# Altium project MASTER_HW.PrjPcb (part 1 of 3)
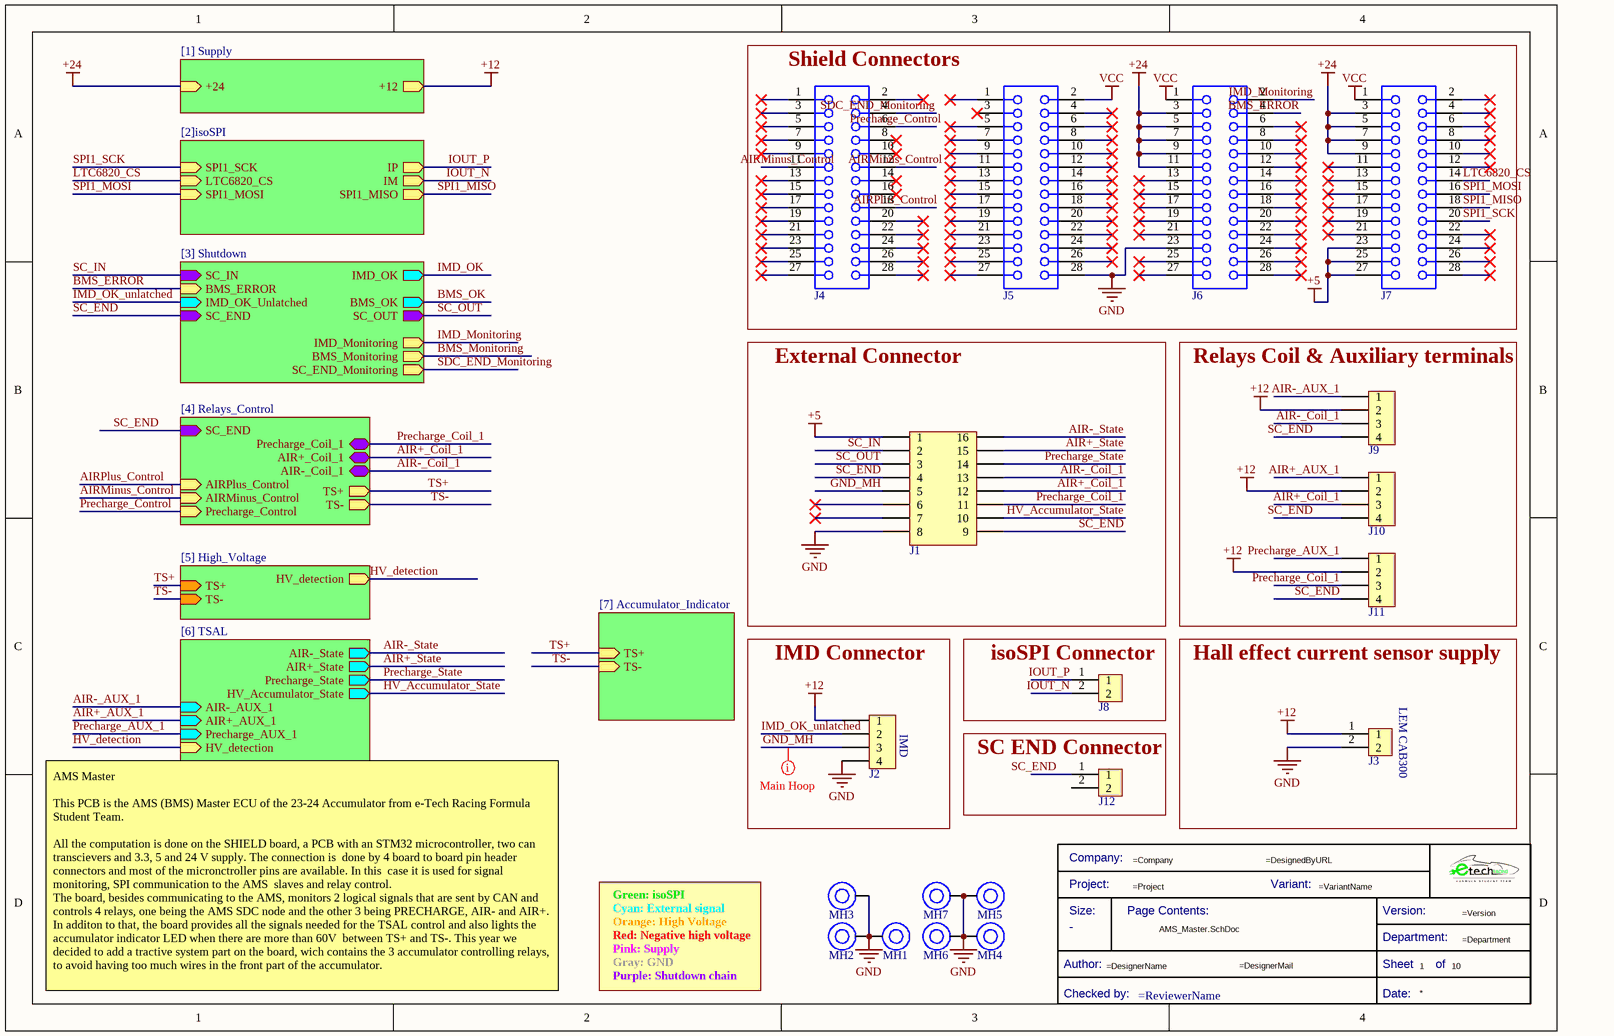
[diagram p0: AMS_Master.SchDoc]
6 sheets, 121 parts. Net scope: hierarchical (ports join the sheet entries above them; power ports are global).
Board file: MASTER_HW.PcbDoc
Sheets:
  AMS_Master.SchDoc
    Shutdown = [3] Shutdown.SchDoc
    High_Voltage = [5] High_Voltage.SchDoc
    Relays_Control = [4] Relays_Control.SchDoc
    TSAL = [6] TSAL.SchDoc
    Designator = [7] Accumulator_Indicator.SchDoc

## Sheet AMS_Master.SchDoc
size A4; DocumentNumber: 0; SheetNumber: 1; SheetTotal: 10

### Parts
(Parts that share a designator on the sheet are numbered #1, #2 ... from top to bottom, then left to right.)
*?#1  Title Block_template  (value not drawn)  (graphical)
J1  1053101116  [J_NanoFit_2x8_V]  (value not drawn)
J2  1053091204  [J_NanoFit_1x4_V]  (value not drawn)
J3  436500215  [J_MicroFit_2x1]  (value not drawn)
J4  62202821821  [62202821821]  (value not drawn)
J5  62202821821  [62202821821]  (value not drawn)
J6  62202821821  [62202821821]  (value not drawn)
J7  62202821821  [62202821821]  (value not drawn)
J8  436500215  [J_MicroFit_2x1]  (value not drawn)
J9  1053091204  [J_NanoFit_1x4_V - duplicate]  (value not drawn)
J10  1053091204  [J_NanoFit_1x4_V - duplicate]  (value not drawn)
J11  1053091204  [J_NanoFit_1x4_V - duplicate]  (value not drawn)
J12  436500215  [J_MicroFit_2x1]  (value not drawn)
MH1  Mounting_Hole_M4  [Mounting_Hole_M4]  (value not drawn)
MH2  Mounting_Hole_M4  [Mounting_Hole_M4]  (value not drawn)
MH3  Mounting_Hole_M4  [Mounting_Hole_M4]  (value not drawn)
MH4  Mounting_Hole_M4  [Mounting_Hole_M4]  (value not drawn)
MH5  Mounting_Hole_M4  [Mounting_Hole_M4]  (value not drawn)
MH6  Mounting_Hole_M4  [Mounting_Hole_M4]  (value not drawn)
MH7  Mounting_Hole_M4  [Mounting_Hole_M4]  (value not drawn)

### Blocks framed on the sheet
Shield Connectors: J4-J7
External Connector: J1
Relays Coil & Auxiliary terminals: J9-J11
IMD Connector: J2
isoSPI Connector: J8
Hall effect current sensor supply: J3
SC END Connector: J12

### Sub-sheets
Designator = [7] Accumulator_Indicator: TS+ (in), TS- (in)
High_Voltage = [5] High_Voltage: HV_detection (out), TS- (in), TS+ (in)
isoSPI = [2]isoSPI (file not in this document): SPI1_SCK (in), LTC6820_CS (in), SPI1_MOSI (in), SPI1_MISO (out), IP (out), IM (out)
Relays_Control = [4] Relays_Control: Precharge_Coil_1 (bidir), AIR+_Coil_1 (bidir), AIR-_Coil_1 (bidir), AIRPlus_Control (in), AIRMinus_Control (in), Precharge_Control (in), SC_END (in), TS+ (out), TS- (out)
Shutdown = [3] Shutdown: BMS_ERROR (in), SC_IN (in), BMS_OK (out), IMD_OK (out), IMD_OK_Unlatched (in), BMS_Monitoring (out), IMD_Monitoring (out), SC_OUT (out), SC_END (in), SC_END_Monitoring (out)
Supply = [1] Supply (file not in this document): +24 (in), +12 (out)
TSAL = [6] TSAL: Precharge_State (out), AIR-_State (out), AIR+_State (out), HV_Accumulator_State (out), HV_detection (in), AIR-_AUX_1 (in), AIR+_AUX_1 (in), Precharge_AUX_1 (in)

### Nets
+5: J1.1 J7.23 J7.25 J7.27
+12: J2.1 J3.1 J9.2 J10.2 J11.2 ; sheet Supply/+12
+24: J6.3 J6.5 J6.7 J6.9 J6.11 J7.3 J7.5 J7.7 J7.9 ; sheet Supply/+24
GND: J1.8 J2.4 J3.2 J5.28 J6.23 MH1.1 MH2.1 MH3.1 MH4.1 MH5.1 MH6.1 MH7.1
VCC: J5.2 J6.1 J7.1
AIR+_AUX_1: J10.1 ; sheet TSAL/AIR+_AUX_1
AIR+_Coil_1: J1.12 J10.3 ; sheet Relays_Control/AIR+_Coil_1
AIR+_State: J1.15 ; sheet TSAL/AIR+_State
AIR-_AUX_1: J9.1 ; sheet TSAL/AIR-_AUX_1
AIR-_Coil_1: J1.13 J9.3 ; sheet Relays_Control/AIR-_Coil_1
AIR-_State: J1.16 ; sheet TSAL/AIR-_State
AIRMinus_Control: J4.11 J4.12 ; sheet Relays_Control/AIRMinus_Control
AIRPlus_Control: J4.18 ; sheet Relays_Control/AIRPlus_Control
BMS_ERROR: J6.4 ; sheet Shutdown/BMS_ERROR
GND_MH: J1.5 J2.3
HV_Accumulator_State: J1.10 ; sheet TSAL/HV_Accumulator_State
HV_detection: sheet High_Voltage/HV_detection, sheet TSAL/HV_detection
IMD_Monitoring: J6.2 ; sheet Shutdown/IMD_Monitoring
IMD_OK_unlatched: J2.2 ; sheet Shutdown/IMD_OK_Unlatched
IOUT_N: J8.2 ; sheet isoSPI/IM
IOUT_P: J8.1 ; sheet isoSPI/IP
LTC6820_CS: J7.14 ; sheet isoSPI/LTC6820_CS
Precharge_AUX_1: J11.1 ; sheet TSAL/Precharge_AUX_1
Precharge_Coil_1: J1.11 J11.3 ; sheet Relays_Control/Precharge_Coil_1
Precharge_Control: J4.6 ; sheet Relays_Control/Precharge_Control
Precharge_State: J1.14 ; sheet TSAL/Precharge_State
SC_END: J1.4 J1.9 J9.4 J10.4 J11.4 J12.1 ; sheet Shutdown/SC_END, sheet Relays_Control/SC_END
SC_IN: J1.2 ; sheet Shutdown/SC_IN
SC_OUT: J1.3 ; sheet Shutdown/SC_OUT
SDC_END_Monitoring: J4.4 ; sheet Shutdown/SC_END_Monitoring  [project net SC_END_Monitoring]
SPI1_MISO: J7.18 ; sheet isoSPI/SPI1_MISO
SPI1_MOSI: J7.16 ; sheet isoSPI/SPI1_MOSI
SPI1_SCK: J7.20 ; sheet isoSPI/SPI1_SCK
TS+: sheet High_Voltage/TS+, sheet Relays_Control/TS+, sheet Designator/TS+
TS-: sheet High_Voltage/TS-, sheet Relays_Control/TS-, sheet Designator/TS-

Not connected (* = marked no-connect by the designer): J1 6* 7*; J4 1* 2* 3* 5* 7* 8* 9* 10* 13* 14* 15* 16* 17* 19* 20* 21* 22* 23* 24* 25* 26* 27* 28*; J5 1* 3* 4* 5* 6* 7* 8* 9* 10* 11* 12* 13* 14* 15* 16* 17* 18* 19* 20* 21* 22* 23* 24* 25* 26* 27*; J6 6* 8* 10* 12* 13* 14* 15* 16* 17* 18* 19* 20* 21* 22* 24* 25* 26* 27* 28*; J7 2* 4* 6* 8* 10* 11* 12* 13* 15* 17* 19* 21* 22* 24* 26* 28*; J12 2

### Layout directives
mark named Main Hoop: GND_MH

### Notes on the sheet
- (near J3) LEM CAB300
- (near J2) IMD
- Cyan: External signal
- Orange: High Voltage
- Green: isoSPI
- AMS Master
  This PCB is the AMS (BMS) Master ECU of the 23-24 Accumulator from e-Tech Racing Formula Student Team.
  All the computation is done on the SHIELD board, a PCB with an STM32 microcontroller, two can transcievers and 3.3, 5 and 24 V supply. The connection is  done by 4 board to board pin header connectors and most of the micronctroller pins are available. In this  case it is used for signal monitoring, SPI communication to the AMS  slaves and relay control.
  The board, besides communicating to the AMS, monitors 2 logical signals that are sent by CAN and controls 4 relays, one being the AMS SDC node and the other 3 being PRECHARGE, AIR- and AIR+.
  In additon to that, the board provides all the signals needed for the TSAL control and also lights the accumulator indicator LED when there are more than 60V  between TS+ and TS-. This year we decided to add a tractive system part on the board, wich contains the 3 accumulator controlling relays, to avoid having too much wires in the front part of the accumulator.
- Red: Negative high voltage
- Gray: GND
- Pink: Supply
- Purple: Shutdown chain
- Title
- Size:
- Date:
- A4
- Number:
- Time:
- Revision:
- Sheet
- of
- File:
- (in symbol Title Block_template) Company:; Project:; Variant:; Size:; Page Contents:; Version:; Department:; Author:; Sheet; of; Checked by:; Date:

### Library data of the parts
*?#1 = Title Block_template: Standard Title Block; Category: Title Block; Checked by:: =ReviewerName; Size: -
J1 = J_NanoFit_2x8_V: Nano-Fit Vertical Header Through Hole 2.50mm Pitch Dual Row 16 Circuits with Kinked Pins Tin (Sn) Plating Black; Manufacturer 1: Molex; Manufacturer Part Number 1: 105310-1116; Connector Type: Header,Male Pin; Number of Positions: 16; .Creator: AC; Supplier 1: Digi-Key; RoHS: No; Category: Headers and Wire Housings; Stock 1: 84; Pricing 1: 1=3,21000, 10=2,82400, 84=2,24619, 1008=1,86110, 4956=1,66858 (USD); Mount: Through Hole; Contact Plating: Tin; Contact Material: Brass; Contact Shape: Square; Insulation Material: Polymer; Insulation Color: Black; Min Operating Temperature: -40°C; Max Operating Temperature: 105°C; Fastening Type: Latch; Packaging: Tray; Number of Rows: 2; Termination: Kinked Pin; ComponentLink1URL: https://www.molex.com/pdm_docs/sd/1053101210_sd.pdf?src-supplier=Digi-Key; ComponentLink1Description: https://www.molex.com/pdm_docs/sd/1053101210_sd.pdf?src-supplier=Digi-Key; Supplier Part Number 1: WM16885-ND; ComponentLink2Description: Molex; ComponentLink2URL: https://www.molex.com/molex/products/part-detail/pcb_headers/1053101116
J2 J9-J11 = J_NanoFit_1x4_V: Nano-Fit Vertical Header Through Hole 2.50mm Pitch Single Row 4 Circuits with Kinked Pins 0.38; Manufacturer 1: Molex; Manufacturer Part Number 1: 105309-1204; .Creator: DO; Supplier 1: Arrow Electronics; RoHS: No; Category: Headers and Wire Housings; Stock 1: 709; Pricing 1: 1=1,37050, 10=1,11700, 100=0,95270, 500=0,86980, 1000=0,74060, 2500=0,71930, 5000=0,68450, 10000=0,66860 (USD); ComponentLink1URL: http://farnell.com//datasheets/2221349.pdf?src-supplier=Farnell; ComponentLink1Description: http://farnell.com//datasheets/2221349.pdf?src-supplier=Farnell; ComponentLink2URL: http://www.farnell.com/datasheets/2221349.pdf?src-supplier=Newark; ComponentLink2Description: http://www.farnell.com/datasheets/2221349.pdf?src-supplier=Newark; ComponentLink3URL: http://www.literature.molex.com/SQLImages/kelmscott/Molex/PDF_Images/987651-1223.PDF?src-supplier=Digi-Key; ComponentLink3Description: http://www.literature.molex.com/SQLImages/kelmscott/Molex/PDF_Images/987651-1223.PDF?src-supplier=Digi-Key; ComponentLink4URL: http://www.farnell.com/datasheets/2059602.pdf?src-supplier=Element14; ComponentLink4Description: http://www.farnell.com/datasheets/2059602.pdf?src-supplier=Element14; Supplier Part Number 1: 105309-1204
J3 J8 J12 = J_MicroFit_2x1: Header 1 Row Vertical Polarizing Peg 2 Pin SMT/Glow Wire Compatible Tin Plate; Manufacturer 1: Molex; Manufacturer Part Number 1: 43650-0215; Supplier 1: Arrow Electronics; RoHS: Yes; Category: Headers and Wire Housings; Stock 1: 11086; Pricing 1: 1=0,87800, 10=0,74400, 80=0,63070, 3264=0,47000, 6528=0,45100, 13056=0,41760 (USD); ComponentLink1URL: https://datasheet.ciiva.com/19462/884109-19462034.pdf?src-supplier=Jameco; ComponentLink1Description: https://datasheet.ciiva.com/19462/884109-19462034.pdf?src-supplier=Jameco; ComponentLink2URL: https://datasheet.ciiva.com/5157/0436500215-pcb-headers-148687-5157608.pdf?src-supplier=Mouser; ComponentLink2Description: https://datasheet.ciiva.com/5157/0436500215-pcb-headers-148687-5157608.pdf?src-supplier=Mouser; ComponentLink3URL: https://datasheet.ciiva.com/16085/0436500215-pcb-headers-16085668.pdf?src-supplier=Onlinecomponents.com; ComponentLink3Description: https://datasheet.ciiva.com/16085/0436500215-pcb-headers-16085668.pdf?src-supplier=Onlinecomponents.com; ComponentLink4URL: https://datasheet.ciiva.com/11748/0900766b80307ce2-11748388.pdf?src-supplier=RSComponents; ComponentLink4Description: https://datasheet.ciiva.com/11748/0900766b80307ce2-11748388.pdf?src-supplier=RSComponents; ComponentLink5URL: https://datasheet.ciiva.com/9432/0436500215-pcb-headers-9432850.pdf?src-supplier=Avnet; ComponentLink5Description: https://datasheet.ciiva.com/9432/0436500215-pcb-headers-9432850.pdf?src-supplier=Avnet; ComponentLink6URL: https://datasheet.ciiva.com/7920/1889390-7920892.pdf?src-supplier=Element14; ComponentLink6Description: https://datasheet.ciiva.com/7920/1889390-7920892.pdf?src-supplier=Element14; Supplier Part Number 1: 43650-0215
J4-J7 = 62202821821: WR-PHD Socket Header, THT, Vertical, pitch 1.27mm, 2 Row, 28P; Manufacturer: Wurth Elektronik; Contact Resistance: 20mΩ; Rated Current: 1A; Working Voltage: 250V; Withstanding Voltage: 500V; ComponentLink1Description: Website Link; ComponentLink1URL: https://www.we-online.com/redexpert/article/62202821821?ad; ComponentLink2Description: Datasheet Link; ComponentLink2URL: https://www.we-online.com/redexpert/spec/62202821821?ad; Manufacturer Part Number: 62202821821; Category: Board-to-Board Connectors; Match Code: WR-PHD; Mount: Through Hole; Operating Temperature Max: 105°C; Operating Temperature Min: -40°C; Packaging: Tube; Gender: Socket Header; Number of Pins: 28; Number of Rows: 2; Orientation: Vertical; Pitch: 1.27mm

## Sheet [3] Shutdown.SchDoc
size A4; DocumentNumber: 4; SheetNumber: 5; SheetTotal: 10
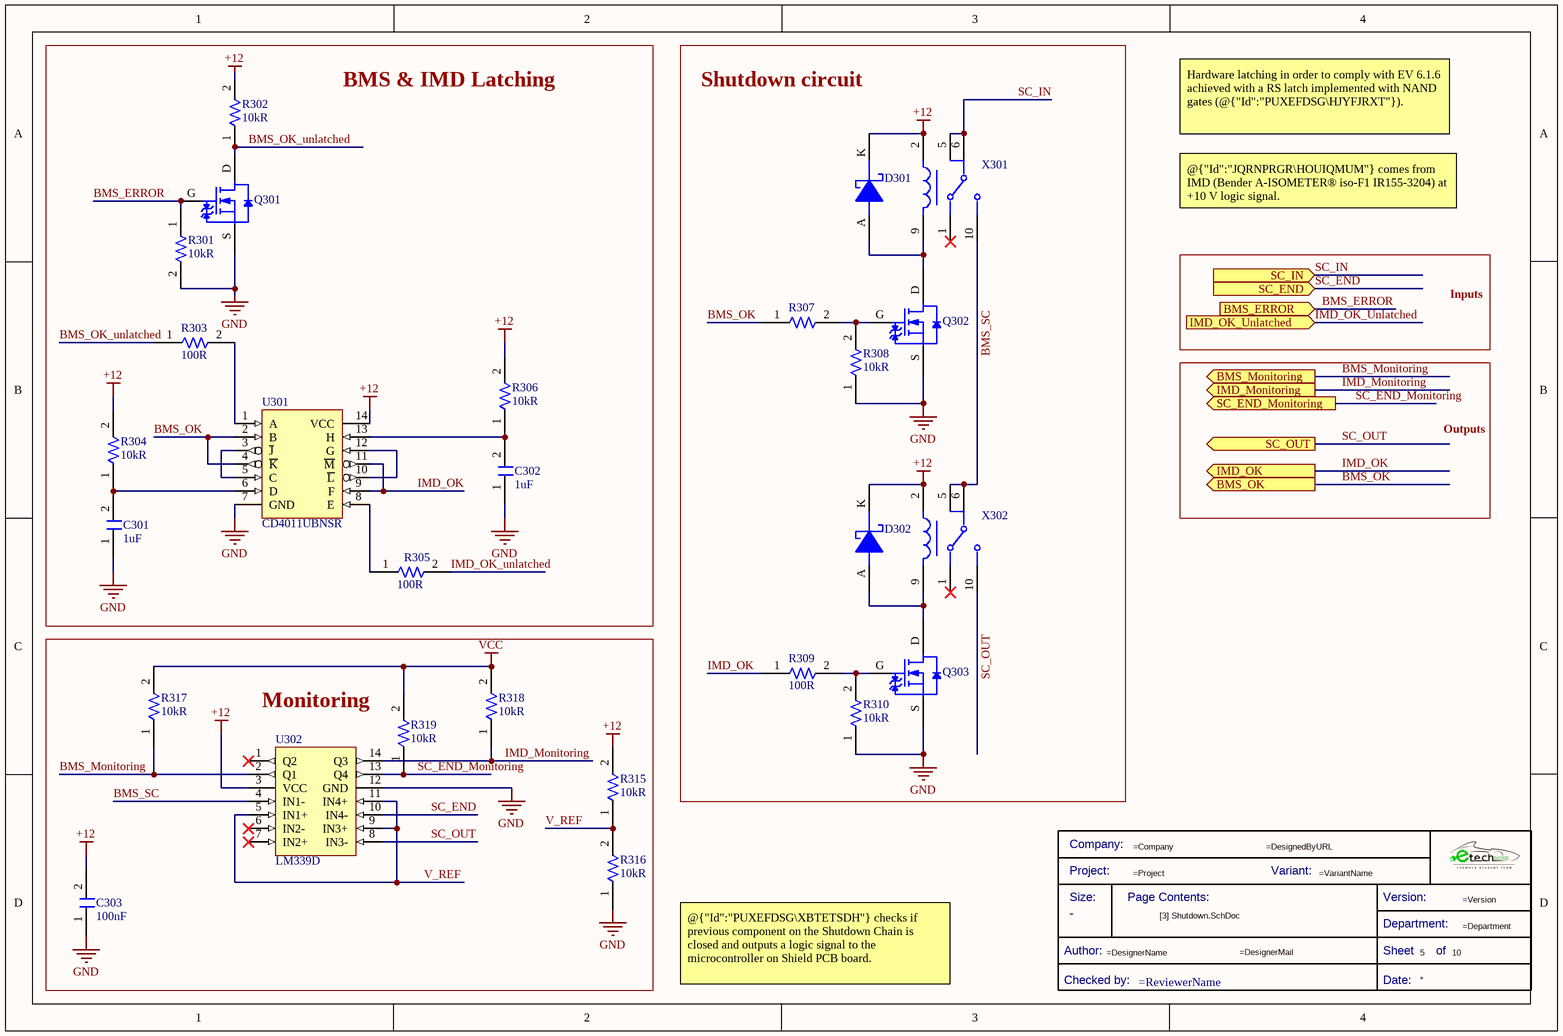
[diagram p1: [3] Shutdown.SchDoc]

### Parts
(Parts that share a designator on the sheet are numbered #1, #2 ... from top to bottom, then left to right.)
*#1  Title Block_template  (value not drawn)  (graphical)
C301  Capacitance: 1uF  [C0805FNPC-R]  (hidden comment: 885012207103)
C302  Capacitance: 1uF  [C0805FNPC-R]  (hidden comment: 885012207103)
C303  Capacitance: 100nF  [C0805FNPC-R]  (hidden comment: 885012207098)
D301  MBR0530  [DSC-SOD123]  (value not drawn)
D302  MBR0530  [DSC-SOD123]  (value not drawn)
Q301  CPH3455-TL-H  [TRT-NCH-3/35-CPH]  (value not drawn)
Q302  CPH3455-TL-H  [TRT-NCH-3/35-CPH]  (value not drawn)
Q303  CPH3455-TL-H  [TRT-NCH-3/35-CPH]  (value not drawn)
R301  Resistance: 10kR  [R0805FTK]  (hidden comment: CR0805-JW-103ELF)
R302  Resistance: 10kR  [R0805FTK]  (hidden comment: CR0805-JW-103ELF)
R303  Resistance: 100R  [R0805FTK]  (hidden comment: CR0805-FX-1000ELF)
R304  Resistance: 10kR  [R0805FTK]  (hidden comment: CR0805-JW-103ELF)
R305  Resistance: 100R  [R0805FTK]  (hidden comment: CR0805-FX-1000ELF)
R306  Resistance: 10kR  [R0805FTK]  (hidden comment: CR0805-JW-103ELF)
R307  CR0805-FX-1000ELF  [R0805FTK]  (value not drawn)
R308  Resistance: 10kR  [R0805FTK]  (hidden comment: CR0805-JW-103ELF)
R309  Resistance: 100R  [R0805FTK]  (hidden comment: CR0805-FX-1000ELF)
R310  Resistance: 10kR  [R0805FTK]  (hidden comment: CR0805-JW-103ELF)
R315  Resistance: 10kR  [R0805FTK]  (hidden comment: CR0805-JW-103ELF)
R316  Resistance: 10kR  [R0805FTK]  (hidden comment: CR0805-JW-103ELF)
R317  Resistance: 10kR  [R0805FTK]  (hidden comment: CR0805-JW-103ELF)
R318  Resistance: 10kR  [R0805FTK]  (hidden comment: CR0805-JW-103ELF)
R319  Resistance: 10kR  [R0805FTK]  (hidden comment: CR0805-JW-103ELF)
U301  Manufacturer Part Number: CD4011UBNSR  [ARRAY_4_NAND]  (hidden comment: CD4011UBSNR)
U302  LM339D  [Array_4_Amp_LM339D]
X301  G5V-1-DC5  [Relay_G5V-1-DC5]  (value not drawn)
X302  G5V-1-DC5  [Relay_G5V-1-DC5]  (value not drawn)

### Blocks framed on the sheet
BMS & IMD Latching: C301 C302 Q301 R301-R306 U301
Shutdown circuit: D301 D302 Q302 Q303 R307-R310 X301 X302
Monitoring: C303 R315-R319 U302

### Ports
BMS_ERROR (in), BMS_Monitoring (out), BMS_OK (out), IMD_Monitoring (out), IMD_OK (out), IMD_OK_Unlatched (in), SC_END (in), SC_END_Monitoring (out), SC_IN (in), SC_OUT (out)

### Nets
+12: C303.2 D301.K D302.K R302.2 R304.2 R306.2 R315.2 U301.14(VCC) U302.3(VCC) X301.2 X302.2
GND: C301.1 C302.1 C303.1 Q301.S Q302.S Q303.S R301.2 R308.1 R310.1 R316.1 U301.7(GND) U302.12(GND)
VCC: R317.2 R318.2 R319.2
BMS_ERROR: Q301.G R301.1 ; port BMS_ERROR
BMS_Monitoring: R317.1 U302.2(Q1) ; port BMS_Monitoring
BMS_OK: R307.1 U301.2(B) U301.4(~{K}) ; port BMS_OK
BMS_OK_unlatched: Q301.D R302.1 R303.1
BMS_SC: U302.4(IN1-) X301.10 X302.5 X302.6
IMD_Monitoring: R318.1 U302.14(Q3) ; port IMD_Monitoring
IMD_OK: R309.1 U301.9(F) U301.11(~{M}) ; port IMD_OK
IMD_OK_unlatched: R305.2 ; port IMD_OK_Unlatched
SC_END: U302.10(IN4-) ; port SC_END
SC_END_Monitoring: R319.1 U302.13(Q4) ; port SC_END_Monitoring
SC_IN: X301.5 X301.6 ; port SC_IN
SC_OUT: U302.8(IN3-) X302.10 ; port SC_OUT
V_REF: R315.1 R316.2 U302.5(IN1+) U302.9(IN3+) U302.11(IN4+)
NetC301_2: C301.2 R304.1 U301.6(D)
NetC302_2: C302.2 R306.1 U301.13(H)
NetD301_A: D301.A Q302.D X301.9
NetD302_A: D302.A Q303.D X302.9
NetQ302_G: Q302.G R307.2 R308.2
NetQ303_G: Q303.G R309.2 R310.2
NetR303_2: R303.2 U301.1(A)
NetR305_1: R305.1 U301.8(E)
NetU301_3: U301.3(~{J}) U301.5(C)
NetU301_10: U301.10(~{L}) U301.12(G)

Not connected (* = marked no-connect by the designer): U302 1(Q2)* 6(IN2-)* 7(IN2+)*; X301 1*; X302 1*

### Notes on the sheet
- Hardware latching in order to comply with EV 6.1.6 achieved with a RS latch implemented with NAND gates (@{"Id":"PUXEFDSG\HJYFJRXT"}).
- @{"Id":"JQRNPRGR\HOUIQMUM"} comes from IMD (Bender A-ISOMETER® iso-F1 IR155-3204) at +10 V logic signal.
- Inputs
- Outputs
- @{"Id":"PUXEFDSG\XBTETSDH"} checks if previous component on the Shutdown Chain is closed and outputs a logic signal to the microcontroller on Shield PCB board.
- Title
- Size:
- Date:
- A4
- Number:
- Time:
- Revision:
- Sheet
- of
- File:
- (in symbol Title Block_template) Company:; Project:; Variant:; Size:; Page Contents:; Version:; Department:; Author:; Sheet; of; Checked by:; Date:

### Library data of the parts
*#1 = Title Block_template: Standard Title Block; Category: Title Block; Checked by:: =ReviewerName; Size: -
C301 C302 = C1u-50V-0805FNPC-X7R: Multilayer Ceramic Capacitor, Wcap-Csgp Series, 1 F, 10%, X7R, 50 V, 0805 [2012 Metric] Rohs Compliant: Yes; Manufacturer 1: Wurth Electronics; Voltage Rating: 50V; .Creator: GP; Supplier 1: RSComponents; Manufacturer Part Number 1: 885012207103; RoHS: Yes; Category: Ceramic Capacitors; Stock 1: 5100; Pricing 1: 50=0,27200, 250=0,25300, 500=0,22800, 1250=0,20100, 2500=0,17100 (GBP); Mount: Surface Mount; Case/Package: 0805; Case Code (Metric): 2012; Case Code (Imperial): 0805; Min Operating Temperature: -55°C; Max Operating Temperature: 85°C; Packaging: Cut Tape; Dielectric: X7R; Tolerance: 10%; Voltage Rating (DC): 50V; Length: 0.079inch; Width: 0.049inch; Thickness: 0.053inch; REACH SVHC: Unknown; RoHS Compliant: Yes; ComponentLink1URL: http://www.farnell.com/datasheets/1958501.pdf?src-supplier=Farnell; ComponentLink1Description: http://www.farnell.com/datasheets/1958501.pdf?src-supplier=Farnell; ComponentLink2URL: http://www.farnell.com/datasheets/1958501.pdf?src-supplier=Element14; ComponentLink2Description: http://www.farnell.com/datasheets/1958501.pdf?src-supplier=Element14; ComponentLink3URL: https://katalog.we-online.de/pbs/datasheet/885012107003.pdf?src-supplier=Digi-Key; ComponentLink3Description: https://katalog.we-online.de/pbs/datasheet/885012107003.pdf?src-supplier=Digi-Key; ComponentLink4URL: http://www.farnell.com/datasheets/1958501.pdf?src-supplier=Newark; ComponentLink4Description: http://www.farnell.com/datasheets/1958501.pdf?src-supplier=Newark; Supplier Part Number 1: 1813523
C303 = C100n-50V-0805FNPC-X7R: Cap, 0.1ΜF, 50V, 10%, X7R, 0805; Manufacturer 1: Wurth Electronics; .Creator: DR; Supplier 1: RSComponents; Manufacturer Part Number 1: 885012207098; RoHS: Yes; Category: Ceramic Capacitors; Stock 1: 8000; Pricing 1: 100=0,10200, 500=0,07100, 2000=0,06100 (GBP); Mount: Surface Mount; Case/Package: 0805; Case Code (Metric): 2012; Case Code (Imperial): 0805; Min Operating Temperature: -55°C; Max Operating Temperature: 125°C; Packaging: Cut Tape; Voltage Rating: 50V; Dielectric: X7R; Tolerance: 10%; Voltage Rating (DC): 50V; Length: 0.079inch; Width: 0.049inch; Thickness: 0.035inch; REACH SVHC: Unknown; RoHS Compliant: Yes; ComponentLink1URL: http://www.farnell.com/datasheets/1958498.pdf?src-supplier=Farnell; ComponentLink1Description: http://www.farnell.com/datasheets/1958498.pdf?src-supplier=Farnell; ComponentLink2URL: http://www.farnell.com/datasheets/1958498.pdf?src-supplier=Element14; ComponentLink2Description: http://www.farnell.com/datasheets/1958498.pdf?src-supplier=Element14; ComponentLink3URL: https://katalog.we-online.de/pbs/datasheet/885012207098.pdf?src-supplier=Digi-Key; ComponentLink3Description: https://katalog.we-online.de/pbs/datasheet/885012207098.pdf?src-supplier=Digi-Key; ComponentLink4URL: http://www.farnell.com/datasheets/1958498.pdf?src-supplier=Newark; ComponentLink4Description: http://www.farnell.com/datasheets/1958498.pdf?src-supplier=Newark; Supplier Part Number 1: 1813493
D301 D302 = DSC-0.5/30-SOD123: VR=30V IF=500mA 30pF P=410mW; Element Configuration: Single; Forward Voltage: 430mV; Peak Non-Repetitive Surge Current: 5.5A; Average Rectified Current: 500mA; Max Reverse Leakage Current: 130uA; Max Reverse Voltage (DC): 30V; Polarity: Standard; .Creator: GP; Category: Diode; ComponentLink1Description: Datasheet; ComponentLink1URL: *; ComponentLink2Description: Where buy it; ComponentLink2URL: *; Supplier 1: Newark; Stock 1: 9; Pricing 1: 1=0,34400, 10=0,23900, 100=0,12200, 500=0,10000 (USD); Mount: Surface Mount; Contact Plating: Tin,Matte; Weight: 0.03g; Package Quantity: 1; Max Surge Current: 5.5A; Forward Current: 500mA; Max Reverse Current: 130uA; Max Repetitive Reverse Voltage (Vrrm): 30V; Max Forward Surge Current (Ifsm): 5.5A; Voltage Rating (DC): 30V; Current Rating: 500mA; Output Current: 500mA; Series: -; Length: 2.7mm; Width: 1.6mm; Height: 1.03mm; Radiation Hardening: No; RoHS Compliant: Yes; REACH SVHC: No SVHC; Lead Free: Lead Free; ComponentLink3URL: https://datasheet.ciiva.com/30479/0900766b810e2512-30479401.pdf?src-supplier=RSComponents; ComponentLink3Description: https://datasheet.ciiva.com/30479/0900766b810e2512-30479401.pdf?src-supplier=RSComponents; ComponentLink4URL: https://datasheet.ciiva.com/34301/974753-34301826.pdf?src-supplier=Jameco; ComponentLink4Description: https://datasheet.ciiva.com/34301/974753-34301826.pdf?src-supplier=Jameco; ComponentLink5URL: https://datasheet.ciiva.com/910/mbr0530-910516.pdf?src-supplier=Digi-Key; ComponentLink5Description: https://datasheet.ciiva.com/910/mbr0530-910516.pdf?src-supplier=Digi-Key; ComponentLink6URL: https://datasheet.ciiva.com/25931/mbr0530-25931989.pdf?src-supplier=Avnet+Europe; ComponentLink6Description: https://datasheet.ciiva.com/25931/mbr0530-25931989.pdf?src-supplier=Avnet+Europe; ComponentLink7URL: https://datasheet.ciiva.com/8300/mbr0530-8300905.pdf?src-supplier=Avnet; ComponentLink7Description: https://datasheet.ciiva.com/8300/mbr0530-8300905.pdf?src-supplier=Avnet; ComponentLink8URL: https://datasheet.ciiva.com/17318/mbr0530-17318568.pdf?src-supplier=Future+Electronics; ComponentLink8Description: https://datasheet.ciiva.com/17318/mbr0530-17318568.pdf?src-supplier=Future+Electronics; ComponentLink9URL: https://datasheet.ciiva.com/15144/getdatasheetpartid-86760-15144598.pdf?src-supplier=Verical; ComponentLink9Description: https://datasheet.ciiva.com/15144/getdatasheetpartid-86760-15144598.pdf?src-supplier=Verical; ComponentLink10URL: https://datasheet.ciiva.com/910/mbr0530-910518.pdf?src-supplier=Digi-Key; ComponentLink10Description: https://datasheet.ciiva.com/910/mbr0530-910518.pdf?src-supplier=Digi-Key; Supplier Part Number 1: 15R3453
Q301-Q303 = TRT-NCH-3/35-CPH: CPH3455-TL-H N-channel MOSFET Transistor; 3 A; 35 V; 3-Pin CPH; Manufacturer: ON Semiconductor; Rds On Max: 104mR; Input Capacitance: 186pF; Rise Time: 4.7ns; Drain to Source Voltage (Vdss): 35V; Continuous Drain Current (ID): 3A; Max Power Dissipation: 1W; Drain to Source Resistance: 108mR; Turn-On Delay Time: 4.2ns; Turn-Off Delay Time: 15ns; Fall Time: 5.7ns; Element Configuration: Single; Gate to Source Voltage (Vgs): 20V; .Creator: GP; Category: Transistor; ComponentLink1Description: Datasheet; ComponentLink1URL: https://docs.rs-online.com/5847/0900766b812d514d.pdf; ComponentLink2Description: Where buy it; ComponentLink2URL: https://es.rs-online.com/web/p/mosfet/8009989; Supplier 1: RSComponents; Manufacturer Part Number: CPH3455-TL-H; RoHS: Yes; Stock 1: 1; Pricing 1: 50=0,50400 (USD); Case/Package: SC; Number of Pins: 3; Min Operating Temperature: -55°C; Max Operating Temperature: 150°C; Package Quantity: 3000; Packaging: Tape and Reel; Drain to Source Breakdown Voltage: 35V; Power Dissipation: 1W; Polarity: N-CHANNEL; Series: -; Length: 2.9mm; Width: 1.6mm; Height: 0.9mm; Lead Free: Lead Free; Halogen Free: Halogen Free; RoHS Compliant: Yes; ComponentLink3URL: https://datasheet.ciiva.com/947/cph3455-d-947201.pdf?src-supplier=Digi-Key; ComponentLink3Description: https://datasheet.ciiva.com/947/cph3455-d-947201.pdf?src-supplier=Digi-Key; ComponentLink4URL: https://datasheet.ciiva.com/4444/cph3455-d-91653-4444616.pdf?src-supplier=Mouser; ComponentLink4Description: https://datasheet.ciiva.com/4444/cph3455-d-91653-4444616.pdf?src-supplier=Mouser; ComponentLink5URL: https://datasheet.ciiva.com/11164/cph3455-d-11164889.pdf?src-supplier=Avnet; ComponentLink5Description: https://datasheet.ciiva.com/11164/cph3455-d-11164889.pdf?src-supplier=Avnet; Supplier Part Number 1: 8009989
R301 R302 R304 R306 R308 R310 R315-R319 = R10k-0805FTK: BOURNS         CR0805-JW-103ELF            Surface Mount Chip Resistor, Thick Film, CR Series, 10 kohm, 125 mW,  5%, 150 V; Temperature Coefficient: 200ppm/°C; Power Rating: 125mW; Voltage Rating: 150V; Voltage Rating (DC): 100V; .Creator: DR; Supplier 1: Arrow Electronics; Manufacturer 1: Bourns; Manufacturer Part Number 1: CR0805-JW-103ELF; RoHS: Yes; Category: Chip SMD Resistors; Stock 1: 57566; Pricing 1: 1=0,05790, 10=0,01540, 25=0,01340, 100=0,00340 (USD); Mount: Surface Mount; Case/Package: 0805; Number of Pins: 2; Contact Plating: Tin; Case Code (Metric): 2012; Case Code (Imperial): 0805; Min Operating Temperature: -55°C; Max Operating Temperature: 155°C; Tolerance: 5%; Resistor Type: Thick Film; Package Quantity: 1; Packaging: Tape and Reel; Number of Terminations: 2; Termination: SMD/SMT; Max Power Dissipation: 125mW; Features: Moisture Resistant; Series: CR0805; Construction: Rectangular; Resistance Tolerance: 5%; Technology: THICK FILM; Length: 2mm; Width: 1.25mm; Height: 0.5mm; Depth: 1.25mm; Thickness: 508um; Radiation Hardening: No; REACH SVHC: No SVHC; Military Standard: Not; RoHS Compliant: Yes; ComponentLink1URL: https://datasheet.ciiva.com/11821/0900766b80fcdb72-11821135.pdf?src-supplier=RSComponents; ComponentLink1Description: https://datasheet.ciiva.com/11821/0900766b80fcdb72-11821135.pdf?src-supplier=RSComponents; ComponentLink2URL: https://datasheet.ciiva.com/9122/chpreztr-9122374.pdf?src-supplier=Avnet; ComponentLink2Description: https://datasheet.ciiva.com/9122/chpreztr-9122374.pdf?src-supplier=Avnet; ComponentLink3URL: https://datasheet.ciiva.com/22693/1902866-22693254.pdf?src-supplier=Element14; ComponentLink3Description: https://datasheet.ciiva.com/22693/1902866-22693254.pdf?src-supplier=Element14; ComponentLink4URL: https://datasheet.ciiva.com/7986/691949-7986187.pdf?src-supplier=Element14; ComponentLink4Description: https://datasheet.ciiva.com/7986/691949-7986187.pdf?src-supplier=Element14; ComponentLink5URL: https://datasheet.ciiva.com/30065/159chpreztr-30065976.pdf?src-supplier=Onlinecomponents.com; ComponentLink5Description: https://datasheet.ciiva.com/30065/159chpreztr-30065976.pdf?src-supplier=Onlinecomponents.com; ComponentLink6URL: https://datasheet.ciiva.com/16783/70154685-16783482.pdf?src-supplier=Allied+Electronics; ComponentLink6Description: https://datasheet.ciiva.com/16783/70154685-16783482.pdf?src-supplier=Allied+Electronics; ComponentLink7URL: https://datasheet.ciiva.com/5548/chpreztr-5548491.pdf?src-supplier=Mouser; ComponentLink7Description: https://datasheet.ciiva.com/5548/chpreztr-5548491.pdf?src-supplier=Mouser; ComponentLink8URL: https://datasheet.ciiva.com/6559/chpreztr-6559900.pdf?src-supplier=Digi-Key; ComponentLink8Description: https://datasheet.ciiva.com/6559/chpreztr-6559900.pdf?src-supplier=Digi-Key; ComponentLink9URL: https://datasheet.ciiva.com/6559/chpreztr-6559901.pdf?src-supplier=Digi-Key; ComponentLink9Description: https://datasheet.ciiva.com/6559/chpreztr-6559901.pdf?src-supplier=Digi-Key; ComponentLink10URL: https://datasheet.ciiva.com/7985/1856384-7985869.pdf?src-supplier=Element14; ComponentLink10Description: https://datasheet.ciiva.com/7985/1856384-7985869.pdf?src-supplier=Element14; ComponentLink11URL: https://datasheet.ciiva.com/48692/001055517-da-01-en-smd-wid-cr0805-jw-103elf-10k-ohm-1-8w-48692118.pdf?src-supplier=Conrad; ComponentLink11Description: https://datasheet.ciiva.com/48692/001055517-da-01-en-smd-wid-cr0805-jw-103elf-10k-ohm-1-8w-48692118.pdf?src-supplier=Conrad; Supplier Part Number 1: CR0805-JW-103ELF
R303 R305 R307 R309 = R100-0805FTK: Res Thick Film 0805 100 Ohm 1% 1/8W ±100ppm/°C Molded SMD SMD Paper Tape on Plastic Reel; Manufacturer 1: Bourns; Power Rating: 125mW; Voltage Rating: 150V; .Creator: DR; Supplier 1: Arrow Electronics; Manufacturer Part Number 1: CR0805-FX-1000ELF; RoHS: Yes; Category: Chip SMD Resistors; Stock 1: 49802; Pricing 1: 1=0,05840, 10=0,03430, 25=0,01780, 100=0,00750, 250=0,00560, 500=0,00490, 3000=0,00470 (USD); Mount: Surface Mount; Case/Package: 0805; Number of Pins: 2; Contact Plating: Tin; Case Code (Imperial): 0805; Case Code (Metric): 2012; Min Operating Temperature: -55°C; Max Operating Temperature: 155°C; Tolerance: 1%; Resistor Type: Thick Film; Temperature Coefficient: 100ppm/°C; Packaging: Tape and Reel; Package Quantity: 1; Termination: SMD/SMT; Number of Terminations: 2; Max Power Dissipation: 125mW; Voltage Rating (DC): 150V; Features: Moisture Resistant; Series: CR0805; Resistance Tolerance: 1%; Construction: Rectangular; Technology: THICK FILM; Length: 2mm; Width: 1.25mm; Height: 0.5mm; Depth: 1.25mm; Thickness: 508um; Radiation Hardening: No; REACH SVHC: No SVHC; Military Standard: Not; RoHS Compliant: Yes; ComponentLink1URL: https://datasheet.ciiva.com/11809/0900766b80fcdb72-11809178.pdf?src-supplier=RSComponents; ComponentLink1Description: https://datasheet.ciiva.com/11809/0900766b80fcdb72-11809178.pdf?src-supplier=RSComponents; ComponentLink2URL: https://datasheet.ciiva.com/6547/chpreztr-6547413.pdf?src-supplier=Digi-Key; ComponentLink2Description: https://datasheet.ciiva.com/6547/chpreztr-6547413.pdf?src-supplier=Digi-Key; ComponentLink3URL: https://datasheet.ciiva.com/6547/chpreztr-6547414.pdf?src-supplier=Digi-Key; ComponentLink3Description: https://datasheet.ciiva.com/6547/chpreztr-6547414.pdf?src-supplier=Digi-Key; ComponentLink4URL: https://datasheet.ciiva.com/6547/chpreztr-6547415.pdf?src-supplier=Digi-Key; ComponentLink4Description: https://datasheet.ciiva.com/6547/chpreztr-6547415.pdf?src-supplier=Digi-Key; ComponentLink5URL: https://datasheet.ciiva.com/9120/chpreztr-9120744.pdf?src-supplier=Avnet; ComponentLink5Description: https://datasheet.ciiva.com/9120/chpreztr-9120744.pdf?src-supplier=Avnet; Supplier Part Number 1: CR0805-FX-1000ELF
U301 = Array_4_NAND: CD4011UB Cmos Quad 2-INPUT Nand; Manufacturer: Texas Instruments; Logic Function: NAND GATE; Min Supply Voltage: 3V; Max Supply Voltage: 18V; Number of Inputs: 2; Propagation Delay: 50ns; Number of Outputs: 1; Number of Circuits: 4; Quiescent Current: 5uA; High Level Output Current: 3.4mA; Output Current: 6.8mA; Turn-On Delay Time: 120ns; .Creator: DO; Supplier 1: Digi-Key; RoHS: Yes; Category: Logic Gates; Stock 1: 964; Pricing 1: 1=0,67000, 10=0,59100, 25=0,55520, 100=0,45320, 250=0,42096, 500=0,35828, 1000=0,29575 (USD); Mount: Surface Mount; Case/Package: SOP; Number of Pins: 14; Weight: 0.007348oz; Contact Plating: Gold; Min Operating Temperature: -55°C; Max Operating Temperature: 125°C; Package Quantity: 1; Packaging: Tape and Reel; Low Level Output Current: 3.4mA; Number of Gates: 4; Number of Input Lines: 2; Number of Output Lines: 1; Number of Elements: 4; Series: 4000B; Technology: CMOS; Number of Bits: 4; Lead Free: Lead Free; RoHS Compliant: Yes; ComponentLink1URL: https://datasheet.ciiva.com/6621/cd4011ub-6621174.pdf?src-supplier=Digi-Key; ComponentLink1Description: https://datasheet.ciiva.com/6621/cd4011ub-6621174.pdf?src-supplier=Digi-Key; ComponentLink2URL: https://datasheet.ciiva.com/6621/cd4011ub-6621175.pdf?src-supplier=Digi-Key; ComponentLink2Description: https://datasheet.ciiva.com/6621/cd4011ub-6621175.pdf?src-supplier=Digi-Key; ComponentLink3URL: https://datasheet.ciiva.com/14307/cd4011ub-mil-14307943.pdf?src-supplier=Avnet; ComponentLink3Description: https://datasheet.ciiva.com/14307/cd4011ub-mil-14307943.pdf?src-supplier=Avnet; ComponentLink4URL: https://datasheet.ciiva.com/6621/cd4011ub-6621176.pdf?src-supplier=Digi-Key; ComponentLink4Description: https://datasheet.ciiva.com/6621/cd4011ub-6621176.pdf?src-supplier=Digi-Key; Supplier Part Number 1: 296-31485-1-ND; ComponentLink5Description: Where buy it; ComponentLink5URL: https://www.digikey.es/es/products/detail/texas-instruments/CD4011UBNSR/1690702?s=N4IgTCBcDaIMIBEAsAGAjGgqgIQHIGUAlAAhAF0BfIA
U302 = Array_4_Amp_LM339D: Comparator Quad ±18V/36V 14-Pin SOIC Tube; Manufacturer: Texas Instruments; Number of Channels: 4; Nominal Supply Current: 2mA; Output Current: 20mA; Quiescent Current: 2.5mA; Max Supply Voltage: 30V; Min Supply Voltage: 2V; Min Dual Supply Voltage: 1V; Max Dual Supply Voltage: 15V; Voltage Gain: 106.02dB; Max Supply Current: 500uA; Input Bias Current: 250nA; Output Current per Channel: 6mA; Input Offset Voltage (Vos): 5mV; Response Time: 0.3us; Output Type: TTL; Dual Supply Voltage: 9V; .Creator: DO; Supplier 1: Digi-Key; RoHS: Yes; Category: Amplifiers - Op Amps, Buffer, Instrumentation; Stock 1: 10834; Pricing 1: 1=0,93000, 10=0,83500, 25=0,79240, 100=0,65090, 250=0,60848, 500=0,53774, 1000=0,46725 (USD); Mount: Surface Mount; Case/Package: SOIC; Number of Pins: 14; Contact Plating: Gold; Weight: 0.004318oz; Min Operating Temperature: 0°C; Max Operating Temperature: 70°C; Packaging: Rail/Tube; Package Quantity: 50; Number of Elements: 4; Supply Current: 2mA; Technology: BIPOLAR; Max Input Current: 250nA; Series: LM339; Length: 8.65mm; Width: 3.91mm; Height: 1.58mm; Radiation Hardening: No; REACH SVHC: No SVHC; Lead Free: Lead Free; RoHS Compliant: Yes; ComponentLink1URL: https://datasheet.ciiva.com/15131/getdatasheetpartid-248452-15131099.pdf?src-supplier=Verical; ComponentLink1Description: https://datasheet.ciiva.com/15131/getdatasheetpartid-248452-15131099.pdf?src-supplier=Verical; ComponentLink2URL: https://datasheet.ciiva.com/1483/1831045-1483000.pdf?src-supplier=Element14; ComponentLink2Description: https://datasheet.ciiva.com/1483/1831045-1483000.pdf?src-supplier=Element14; ComponentLink3URL: https://datasheet.ciiva.com/1827/lm139a-1827534.pdf?src-supplier=Digi-Key; ComponentLink3Description: https://datasheet.ciiva.com/1827/lm139a-1827534.pdf?src-supplier=Digi-Key; ComponentLink4URL: https://datasheet.ciiva.com/2970/lm2901-2970484.pdf?src-supplier=Avnet; ComponentLink4Description: https://datasheet.ciiva.com/2970/lm2901-2970484.pdf?src-supplier=Avnet; ComponentLink5URL: https://datasheet.ciiva.com/48712/001010753-da-01-en-ic-quad-diff-comp-lm339d-soic-14-tid-48712470.pdf?src-supplier=Conrad; ComponentLink5Description: https://datasheet.ciiva.com/48712/001010753-da-01-en-ic-quad-diff-comp-lm339d-soic-14-tid-48712470.pdf?src-supplier=Conrad; Supplier Part Number 1: 296-1013-5-ND; ComponentLink6Description: Where buy it; ComponentLink6URL: https://es.rs-online.com/web/p/comparadores/0858411; Manufacturer Part Number: LM339D
X301 X302 = Relay_G5V-1-DC5: Electromechanical Relay SPDT 1A 5VDC 167Ohm Through Hole; Manufacturer: Omron; Max Voltage Rating (AC): 125V; Max Voltage Rating (DC): 60V; Coil Current: 30mA; Operate Time: 5ms; Coil Power: 150mW; Coil Resistance: 167R; Coil Type: Non-Latching; Coil Voltage (DC): 5V; Number of Poles: 1; Relay Type: General Purpose; Insulation Resistance: 1GR; Approvals: UL,CSA; .Creator: DO; Supplier 1: Avnet; Manufacturer Part Number: G5V-1-DC5; RoHS: Yes; Category: Signal Relays; Stock 1: 10; Pricing 1: 1=1,32941, 10=1,30681, 30=1,28421, 50=1,25430, 100=1,24300 (USD); Mount: Through Hole,PCB; Case/Package: DIP; Number of Pins: 6; Contact Material: Gold,Silver; Min Operating Temperature: -40°C; Max Operating Temperature: 70°C; Contact Current Rating: 1A; Max Current Rating: 1A; Throw Configuration: SPDT; Termination: PC Pin; Packaging: Bulk; Power Consumption: 150mW; Package Quantity: 25; Voltage Rating (AC): 125V; Voltage Rating (DC): 60V; Release Time: 5ms; Current Rating: 1A; Type: Electromechanical; Length: 12.5mm; Width: 7.5mm; Height: 10mm; Depth: 7.5mm; Radiation Hardening: No; REACH SVHC: Unknown; Lead Free: Lead Free; ComponentLink1URL: https://datasheet.ciiva.com/1525/96550-1525281.pdf?src-supplier=Element14; ComponentLink1Description: https://datasheet.ciiva.com/1525/96550-1525281.pdf?src-supplier=Element14; ComponentLink2URL: https://datasheet.ciiva.com/19455/187240-19455238.pdf?src-supplier=Jameco; ComponentLink2Description: https://datasheet.ciiva.com/19455/187240-19455238.pdf?src-supplier=Jameco; ComponentLink3URL: https://datasheet.ciiva.com/26921/getdatasheetpartid-765626-26921061.pdf?src-supplier=Verical; ComponentLink3Description: https://datasheet.ciiva.com/26921/getdatasheetpartid-765626-26921061.pdf?src-supplier=Verical; ComponentLink4URL: https://datasheet.ciiva.com/18421/70175634-18421511.pdf?src-supplier=Allied+Electronics; ComponentLink4Description: https://datasheet.ciiva.com/18421/70175634-18421511.pdf?src-supplier=Allied+Electronics; ComponentLink5URL: https://datasheet.ciiva.com/15718/g5v-1-15718184.pdf?src-supplier=Onlinecomponents.com; ComponentLink5Description: https://datasheet.ciiva.com/15718/g5v-1-15718184.pdf?src-supplier=Onlinecomponents.com; ComponentLink6URL: https://datasheet.ciiva.com/2416/g5v-1-0911-2416495.pdf?src-supplier=Digi-Key; ComponentLink6Description: https://datasheet.ciiva.com/2416/g5v-1-0911-2416495.pdf?src-supplier=Digi-Key; ComponentLink7URL: https://datasheet.ciiva.com/30083/en-g5v-1-30083503.pdf?src-supplier=Onlinecomponents.com; ComponentLink7Description: https://datasheet.ciiva.com/30083/en-g5v-1-30083503.pdf?src-supplier=Onlinecomponents.com; ComponentLink8Description: Where buy it; ComponentLink8URL: https://es.rs-online.com/web/p/reles-sin-enclavamiento/8411420/?relevancy-data=7365617263685F636173636164655F6F726465723D31267365617263685F696E746572666163655F6E616D653D4931384E53656172636847656E65726963267365617263685F6C616E67756167655F757365643D6573267365617263685F6D617463685F6D6F64653D6D61746368616C6C7061727469616C267365617263685F7061747465726E5F6D6174636865643D5E5B5C707B4C7D5C707B4E647D2D2C2F255C2E5D2B24267365617263685F7061747465726E5F6F726465723D313333267365617263685F73745F6E6F726D616C697365643D59267365617263685F726573706F6E73655F616374696F6E3D267365617263685F747970653D4B4559574F52445F53494E474C455F414C5048415F4E554D45524943267365617263685F7370656C6C5F636F72726563745F6170706C6965643D59267365617263685F77696C645F63617264696E675F6D6F64653D4E4F4E45267365617263685F6B6579776F72643D4735562D312D444335267365617263685F6B6579776F72645F6170703D4735562D312D444335267365617263685F636F6E6669673D3126&searchHistory=%7B%22enabled%22%3Atrue%7D; Supplier Part Number 1: G5V-1-DC5